# Altium schematic sheet io_connectors.SchDoc
size Tabloid; Organization: CMU Robotics Institute; Address1: Suite 780; Address2: 5001 Baum Blvd; Address3: Pittsburgh, PA 15213; Address4: USA
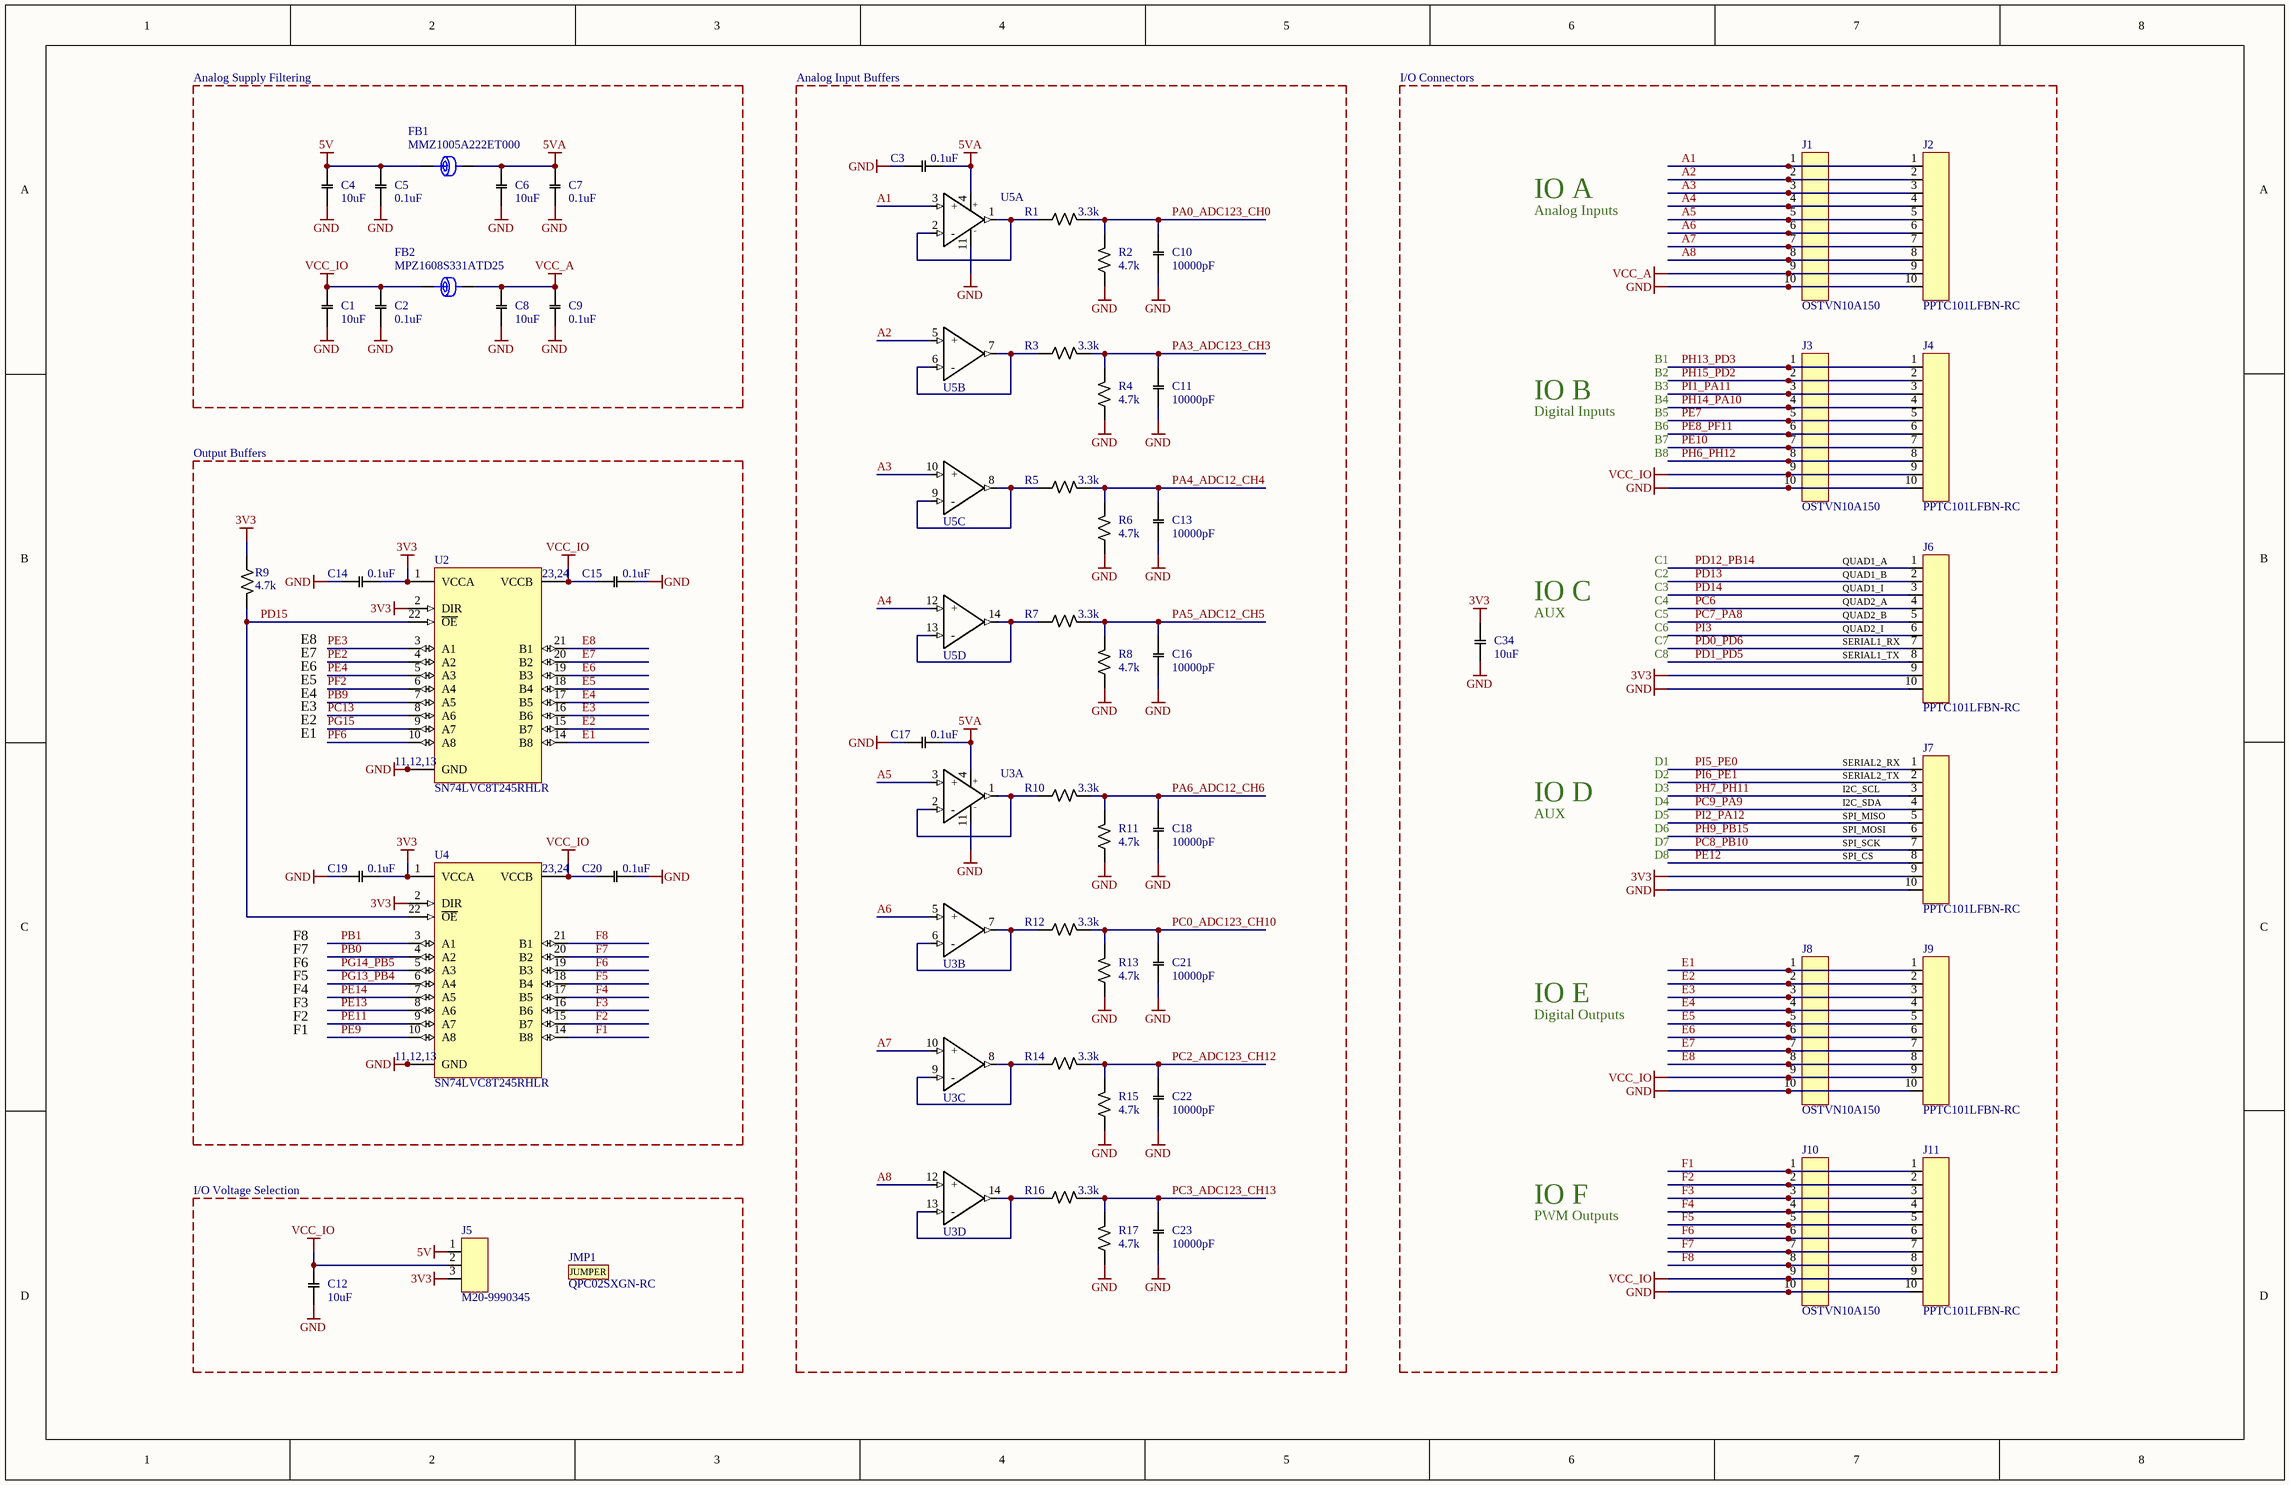
[diagram p0: io_connectors.SchDoc]

## Parts
C1  Capacitance: 10uF  [C0805]  (hidden comment: C-10uf-X5R-25V-10%-0805)
C2  Capacitance: 0.1uF  [C0402]  (hidden comment: C-0.1uf-X7R-25V-10%-0402)
C3  Capacitance: 0.1uF  [C0402]  (hidden comment: C-0.1uf-X7R-25V-10%-0402)
C4  Capacitance: 10uF  [C0805]  (hidden comment: C-10uf-X5R-25V-10%-0805)
C5  Capacitance: 0.1uF  [C0402]  (hidden comment: C-0.1uf-X7R-25V-10%-0402)
C6  Capacitance: 10uF  [C0805]  (hidden comment: C-10uf-X5R-25V-10%-0805)
C7  Capacitance: 0.1uF  [C0402]  (hidden comment: C-0.1uf-X7R-25V-10%-0402)
C8  Capacitance: 10uF  [C0805]  (hidden comment: C-10uf-X5R-25V-10%-0805)
C9  Capacitance: 0.1uF  [C0402]  (hidden comment: C-0.1uf-X7R-25V-10%-0402)
C10  Capacitance: 10000pF  [C0402]  (hidden comment: C-10000pf-X7R-50V-10%-0402)
C11  Capacitance: 10000pF  [C0402]  (hidden comment: C-10000pf-X7R-50V-10%-0402)
C12  Capacitance: 10uF  [C0805]  (hidden comment: C-10uf-X5R-25V-10%-0805)
C13  Capacitance: 10000pF  [C0402]  (hidden comment: C-10000pf-X7R-50V-10%-0402)
C14  Capacitance: 0.1uF  [C0402]  (hidden comment: C-0.1uf-X7R-25V-10%-0402)
C15  Capacitance: 0.1uF  [C0402]  (hidden comment: C-0.1uf-X7R-25V-10%-0402)
C16  Capacitance: 10000pF  [C0402]  (hidden comment: C-10000pf-X7R-50V-10%-0402)
C17  Capacitance: 0.1uF  [C0402]  (hidden comment: C-0.1uf-X7R-25V-10%-0402)
C18  Capacitance: 10000pF  [C0402]  (hidden comment: C-10000pf-X7R-50V-10%-0402)
C19  Capacitance: 0.1uF  [C0402]  (hidden comment: C-0.1uf-X7R-25V-10%-0402)
C20  Capacitance: 0.1uF  [C0402]  (hidden comment: C-0.1uf-X7R-25V-10%-0402)
C21  Capacitance: 10000pF  [C0402]  (hidden comment: C-10000pf-X7R-50V-10%-0402)
C22  Capacitance: 10000pF  [C0402]  (hidden comment: C-10000pf-X7R-50V-10%-0402)
C23  Capacitance: 10000pF  [C0402]  (hidden comment: C-10000pf-X7R-50V-10%-0402)
C34  Capacitance: 10uF  [C0805]  (hidden comment: C-10uf-X5R-25V-10%-0805)
FB1  MMZ1005A222ET000  [FB0402]
FB2  MPZ1608S331ATD25  [FB0603]
J1  OSTVN10A150  [OSTVN10A150]
J2  PPTC101LFBN-RC  [PPTC101LFBN-RC]
J3  OSTVN10A150  [OSTVN10A150]
J4  PPTC101LFBN-RC  [PPTC101LFBN-RC]
J5  M20-9990345  [M20-9990345]
J6  PPTC101LFBN-RC  [PPTC101LFBN-RC]
J7  PPTC101LFBN-RC  [PPTC101LFBN-RC]
J8  OSTVN10A150  [OSTVN10A150]
J9  PPTC101LFBN-RC  [PPTC101LFBN-RC]
J10  OSTVN10A150  [OSTVN10A150]
J11  PPTC101LFBN-RC  [PPTC101LFBN-RC]
JMP1  QPC02SXGN-RC  (mechanical)
R1  Resistance: 3.3k  [R0402]  (hidden comment: R-3.3k-0.1%-0.063w-0402)
R2  Resistance: 4.7k  [R0402]  (hidden comment: R-4.7k-0.1%-0.063w-0402)
R3  Resistance: 3.3k  [R0402]  (hidden comment: R-3.3k-0.1%-0.063w-0402)
R4  Resistance: 4.7k  [R0402]  (hidden comment: R-4.7k-0.1%-0.063w-0402)
R5  Resistance: 3.3k  [R0402]  (hidden comment: R-3.3k-0.1%-0.063w-0402)
R6  Resistance: 4.7k  [R0402]  (hidden comment: R-4.7k-0.1%-0.063w-0402)
R7  Resistance: 3.3k  [R0402]  (hidden comment: R-3.3k-0.1%-0.063w-0402)
R8  Resistance: 4.7k  [R0402]  (hidden comment: R-4.7k-0.1%-0.063w-0402)
R9  Resistance: 4.7k  [R0402]  (hidden comment: R-4.7k-1%-0.063w-0402)
R10  Resistance: 3.3k  [R0402]  (hidden comment: R-3.3k-0.1%-0.063w-0402)
R11  Resistance: 4.7k  [R0402]  (hidden comment: R-4.7k-0.1%-0.063w-0402)
R12  Resistance: 3.3k  [R0402]  (hidden comment: R-3.3k-0.1%-0.063w-0402)
R13  Resistance: 4.7k  [R0402]  (hidden comment: R-4.7k-0.1%-0.063w-0402)
R14  Resistance: 3.3k  [R0402]  (hidden comment: R-3.3k-0.1%-0.063w-0402)
R15  Resistance: 4.7k  [R0402]  (hidden comment: R-4.7k-0.1%-0.063w-0402)
R16  Resistance: 3.3k  [R0402]  (hidden comment: R-3.3k-0.1%-0.063w-0402)
R17  Resistance: 4.7k  [R0402]  (hidden comment: R-4.7k-0.1%-0.063w-0402)
U2  SN74LVC8T245RHLR  [R-PVQFN-N24_TI]
U3  TSV324IPT  [TSSOP14_ST]  (value not drawn)  (parts A,B,C,D of 4)
U4  SN74LVC8T245RHLR  [R-PVQFN-N24_TI]
U5  TSV324IPT  [TSSOP14_ST]  (value not drawn)  (parts A,B,C,D of 4)

## Blocks framed on the sheet
Analog Supply Filtering: C1 C2 C4-C9 FB1 FB2
Analog Input Buffers: C3 C10 C11 C13 C16-C18 C21-C23 R1-R8 R10-R17 U3 U5
I/O Voltage Selection: C12 J5 JMP1

## Nets
3V3: C14.2 C19.2 C34.2 J5.3 J6.9 J7.9 R9.1 U2.1(VCCA) U2.2(DIR) U4.1(VCCA) U4.2(DIR)
5V: C4.2 C5.1 FB1.1 J5.1
5VA: C3.1 C6.2 C7.1 C17.1 FB1.2 U3.4(V+) U5.4(V+)
GND: C1.1 C2.2 C3.2 C4.1 C5.2 C6.1 C7.2 C8.1 C9.1 C10.1 C11.1 C12.1 C13.1 C14.1 C15.1 C16.1 C17.2 C18.1 C19.1 C20.1 C21.1 C22.1 C23.1 C34.1 J1.10 J2.10 J3.10 J4.10 J6.10 J7.10 J8.10 J9.10 J10.10 J11.10 R2.1 R4.1 R6.1 R8.1 R11.1 R13.1 R15.1 R17.1 U2.11(GND) U2.12(GND) U2.13(GND) U3.11(V-) U4.11(GND) U4.12(GND) U4.13(GND) U5.11(V-)
VCC_A: C8.2 C9.2 FB2.2 J1.9 J2.9
VCC_IO: C1.2 C2.1 C12.2 C15.2 C20.2 FB2.1 J3.9 J4.9 J5.2 J8.9 J9.9 J10.9 J11.9 U2.23(VCCB) U2.24(VCCB) U4.23(VCCB) U4.24(VCCB)
A1: J1.1 J2.1 U5.3(+)
A2: J1.2 J2.2 U5.5(+)
A3: J1.3 J2.3 U5.10(+)
A4: J1.4 J2.4 U5.12(+)
A5: J1.5 J2.5 U3.3(+)
A6: J1.6 J2.6 U3.5(+)
A7: J1.7 J2.7 U3.10(+)
A8: J1.8 J2.8 U3.12(+)
E1: J8.1 J9.1 U2.14(B8)
E2: J8.2 J9.2 U2.15(B7)
E3: J8.3 J9.3 U2.16(B6)
E4: J8.4 J9.4 U2.17(B5)
E5: J8.5 J9.5 U2.18(B4)
E6: J8.6 J9.6 U2.19(B3)
E7: J8.7 J9.7 U2.20(B2)
E8: J8.8 J9.8 U2.21(B1)
F1: J10.1 J11.1 U4.14(B8)
F2: J10.2 J11.2 U4.15(B7)
F3: J10.3 J11.3 U4.16(B6)
F4: J10.4 J11.4 U4.17(B5)
F5: J10.5 J11.5 U4.18(B4)
F6: J10.6 J11.6 U4.19(B3)
F7: J10.7 J11.7 U4.20(B2)
F8: J10.8 J11.8 U4.21(B1)
PA0_ADC123_CH0: C10.2 R1.2 R2.2
PA3_ADC123_CH3: C11.2 R3.2 R4.2
PA4_ADC12_CH4: C13.2 R5.2 R6.2
PA5_ADC12_CH5: C16.2 R7.2 R8.2
PA6_ADC12_CH6: C18.2 R10.2 R11.2
PB0: U4.4(A2)
PB1: U4.3(A1)
PB9: U2.7(A5)
PC0_ADC123_CH10: C21.2 R12.2 R13.2
PC2_ADC123_CH12: C22.2 R14.2 R15.2
PC3_ADC123_CH13: C23.2 R16.2 R17.2
PC6: J6.4
PC7_PA8: J6.5
PC8_PB10: J7.7
PC9_PA9: J7.4
PC13: U2.8(A6)
PD0_PD6: J6.7
PD1_PD5: J6.8
PD12_PB14: J6.1
PD13: J6.2
PD14: J6.3
PD15: R9.2 U2.22(~{OE}) U4.22(~{OE})
PE2: U2.4(A2)
PE3: U2.3(A1)
PE4: U2.5(A3)
PE7: J3.5 J4.5
PE8_PF11: J3.6 J4.6
PE9: U4.10(A8)
PE10: J3.7 J4.7
PE11: U4.9(A7)
PE12: J7.8
PE13: U4.8(A6)
PE14: U4.7(A5)
PF2: U2.6(A4)
PF6: U2.10(A8)
PG13_PB4: U4.6(A4)
PG14_PB5: U4.5(A3)
PG15: U2.9(A7)
PH6_PH12: J3.8 J4.8
PH7_PH11: J7.3
PH9_PB15: J7.6
PH13_PD3: J3.1 J4.1
PH14_PA10: J3.4 J4.4
PH15_PD2: J3.2 J4.2
PI1_PA11: J3.3 J4.3
PI2_PA12: J7.5
PI3: J6.6
PI5_PE0: J7.1
PI6_PE1: J7.2
NetR1_1: R1.1 U5.1(OUT) U5.2(-)
NetR3_1: R3.1 U5.6(-) U5.7(OUT)
NetR5_1: R5.1 U5.8(OUT) U5.9(-)
NetR7_1: R7.1 U5.13(-) U5.14(OUT)
NetR10_1: R10.1 U3.1(OUT) U3.2(-)
NetR12_1: R12.1 U3.6(-) U3.7(OUT)
NetR14_1: R14.1 U3.8(OUT) U3.9(-)
NetR16_1: R16.1 U3.13(-) U3.14(OUT)

## Notes on the sheet
- I/O Connectors
- IO A
- Analog Inputs
- B1
- IO B
- Digital Inputs
- B2
- B3
- B4
- B5
- B6
- Output Buffers
- B7
- B8
- C1
- (near J6) QUAD1_A
- IO C
- AUX
- C2
- C3
- C4
- C5
- C6
- (near J6) QUAD1_B
- (near J6) QUAD1_I
- (near J6) QUAD2_A
- (near J6) QUAD2_B
- (near J6) QUAD2_I
- E4
- E5
- E6
- E7
- E8
- C7
- C8
- (near J6) SERIAL1_RX
- (near J6) SERIAL1_TX
- E1
- E2
- E3
- D1
- (near J7) SERIAL2_RX
- IO D
- D2
- D3
- D4
- D5
- D6
- (near J7) SPI_MISO
- (near J7) I2C_SCL
- (near J7) I2C_SDA
- (near J7) SERIAL2_TX
- (near J7) SPI_MOSI
- D7
- D8
- (near J7) SPI_SCK
- (near J7) SPI_CS
- F8
- F7
- F6
- F5
- F4
- F3
- F2
- F1
- IO E
- Digital Outputs
- IO F
- PWM Outputs
- Title
- Size:
- Date:
- Tabloid
- Number:
- Time:
- Revision:
- Sheet
- of
- File:
- (in symbol CMP-500-0004-4) 23,24; 11,12,13
- (in symbol CMP-1305-000000-1) JUMPER

## Library data of the parts
C1 C4 C6 C8 C12 C34 = CMP-00042-6: Capacitor Ceramic 10uF 25V X5R 10% SMD 0805; Tolerance: 10%; Voltage - Rated: 25V; Temperature Coefficient: X5R; Operating Temperature: -55°C ~ 85°C; Package / Case: 0805
C2 C3 C5 C7 C9 C14 C15 C17 C19 C20 = CMP-00040-11: Capacitor Ceramic 0.1uF 25V X7R 10% SMD 0402; Tolerance: 10%; Voltage - Rated: 25V; Temperature Coefficient: X7R; Operating Temperature: -55°C ~ 125°C; Package / Case: 0402
C10 C11 C13 C16 C18 C21-C23 = CMP-00041-8: Capacitor Ceramic 10000pF 50V X7R 10% SMD 0402; Tolerance: 10%; Voltage - Rated: 50V; Temperature Coefficient: X7R; Operating Temperature: -55°C ~ 125°C; Package / Case: 0402
FB1 = CMP-00233-4: FERRITE BEAD 2.2 KOHM 0402 1LN; Filter Type: Signal Line; Number of Lines: 1; Current Rating (Max): 150mA; DC Resistance (DCR) (Max): 2.2 Ohm; ComponentLink1URL: https://product.tdk.com/info/en/catalog/datasheets/beads_commercial_signal_mmz1005-e_en.pdf; ComponentLink1Description: Datasheet; Lead Free Status / RoHS Status: RoHS Compliant; Category: Filters; Package / Case: 0402 (1005 Metric); Mounting Type: Surface Mount; Height (Max): 0.022" (0.55mm); Size / Dimension: 0.039" L x 0.020" W (1.00mm x 0.50mm); Ratings: -; Operating Temperature: -55°C ~ 125°C
FB2 = CMP-00231-5: FERRITE CHIP 330 OHM 1.7A 0603; DC Resistance (DCR): 80 mOhm Max; ComponentLink1URL: http://product.tdk.com/en/catalog/datasheets/beads_automotive_power_mpz_en.pdf; ComponentLink1Description: Datasheet; Lead Free Status / RoHS Status: RoHS Compliant; Category: Filters; Filter Type: -; Package / Case: 0603 (1608 Metric); Mounting Type: Surface Mount; Height (Max): 0.037" (0.95mm); Size / Dimension: 0.063" L x 0.031" W (1.60mm x 0.80mm); Current Rating: 1.7A
J1 J3 J8 J10 = CMP-00332-3: CONN TERM BLOCK 2.54MM 10POS PCB; Manufacturer: On Shore Technology Inc.; Pitch: 0.100" (2.54mm); Number of Levels: 1; Positions Per Level: 10; Mating Orientation: Horizontal with Board; Current: 6A; Voltage: 125V; Wire Gauge: 20-30 AWG; Wire Termination: Screw - Rising Cage Clamp; Clamp Material - Plating: Brass; Screw Material - Plating: Steel - Zinc Plated; Torque - Screw: 0.15 Nm (1.3 Lb-In); Screw Thread: M1.6; Manufacturer Part Number: OSTVN10A150; Lead Free Status / RoHS Status: RoHS Compliant; Category: Connectors, Interconnects; Mounting Type: Through Hole; Features: -; Color: Green; ComponentLink1URL: http://www.on-shore.com/sites/default/files/manuals/ostvnxxa150.pdf; ComponentLink1Description: Datasheet; Operating Temperature: -30°C ~ 105°C; Housing Material: Thermoplastic; Contact Material - Plating: Brass
J2 J4 J6 J7 J9 J11 = CMP-391-0001-1: CONN HEADER FEMALE 10POS.1" TIN; Manufacturer: Sullins Connector Solutions; Pitch: 0.100" (2.54mm); Number of Positions: 10; Number of Positions Loaded: All; Manufacturer Part Number: PPTC101LFBN-RC; Lead Free Status / RoHS Status: RoHS Compliant; Category: Connectors, Interconnects; Mounting Type: Through Hole; Features: -; Color: Black; ComponentLink1URL: Datasheet; ComponentLink1Description: http://www.sullinscorp.com/drawings/78_P(N)PxCxxxLFBN-RC,_10492-H.pdf; Connector Type: Header; Contact Type: Female Socket; Number of Rows: 1; Row Spacing: -; Termination: Solder; Fastening Type: -; Contact Finish: Tin; Contact Finish Thickness: -
J5 = CMP-00314-2: CONN HEADER VERT 3POS 2.54MM; Manufacturer: Harwin Inc.; Connector Type: Header, Unshrouded, Breakaway; Number of Positions: 3; Number of Positions Loaded: All; Pitch: 0.100" (2.54mm); Manufacturer Part Number: M20-9990345; Lead Free Status / RoHS Status: RoHS Compliant; ComponentLink1Description: Datasheet; ComponentLink1URL: http://cdn.harwin.com/pdfs/M20-999.pdf; Category: Connectors, Interconnects; Contact Type: Male Pin; Number of Rows: 1; Row Spacing: -; Contact Mating Length: 0.240" (6.10mm); Mounting Type: Through Hole; Termination: Solder; Fastening Type: -; Features: -; Contact Finish: Gold; Contact Finish Thickness: -; Color: Black
JMP1 = CMP-1305-000000-1: CONN JUMPER SHORTING .100" GOLD; Manufacturer: Sullins; Pitch: 0.1inch; Number of Positions: 2; Manufacturer Part Number: QPC02SXGN-RC; Lead Free Status / RoHS Status: RoHS Compliant; Height: 0.235inch; ComponentLink1URL: https://s3.amazonaws.com/catalogspreads-pdf/PAGE128-129%20.100%20JUMPER.pdf; ComponentLink1Description: https://s3.amazonaws.com/catalogspreads-pdf/PAGE128-129%20.100%20JUMPER.pdf; Case/Package: 100; Contact Plating: Gold; Package Quantity: 2000; Lead Free: Lead Free
R1 R3 R5 R7 R10 R12 R14 R16 = CMP-00138-3: Resistor 0402 3.3k Ohm 0.1% 1-16 Watt; Power: 0.063W, 1/16W; Package / Case: 0402; Part Name: R-3.3k-0.1%-0.063w-0402; Tolerance (%): ±0.1%
R2 R4 R6 R8 R11 R13 R15 R17 = CMP-00137-3: Resistor 0402 4.7k Ohm 0.1% 1-16 Watt; Power: 0.063W, 1/16W; Package / Case: 0402; Part Name: R-4.7k-0.1%-0.063w-0402; Tolerance (%): ±0.1%
R9 = CMP-00107-4: Resistor 0402 4.7k Ohm 1% 1-16 Watt; Power: 0.063W, 1/16W; Package / Case: 0402; Part Name: R-4.7k-1%-0.063w-0402; Tolerance (%): ±1%
U2 U4 = CMP-500-0004-4: IC BUS TRANSCVR 8BIT 24QFN; Data Rate: 500Mbps; Logic Function: Translator,Transceiver; Number of Bits: 8; Quiescent Current: 15uA; Min Supply Voltage: 1.65V; Max Supply Voltage: 5.5V; Propagation Delay: 4.3ns; Polarity: Non-Inverting; Direction: Bidirectional; Number of Elements: 1; Turn-On Delay Time: 4.2ns; Low Level Output Current: 32mA; High Level Output Current: -32mA; ComponentLink1Description: Datasheet; ComponentLink1URL: https://www.ti.com/lit/ds/symlink/sn74lvc8t245.pdf?HQS=dis-dk-null-digikeymode-dsf-pf-null-wwe&ts=1610745639078; Number of Channels: 8; REACH SVHC: No SVHC; Contact Plating: Gold; Max Operating Temperature: 85°C; Radiation Hardening: No; Height: 0.95mm; Packaging: Tape and Reel; Nominal Supply Current: 15uA; Number of Pins: 24; Package Quantity: 1; Lead Free: Lead Free; Weight: 0.001767oz; Min Operating Temperature: -40°C; Number of Outputs: 8; Width: 3.65mm; Number of Inputs: 8; Case/Package: VQFN; Mount: Surface Mount; Length: 5.65mm; Output Current: 32mA
U3 U5 = CMP-736-0002-1: IC OPAMP GP 1.4MHZ RRO 14TSSOP; Manufacturer: STMicroelectronics; Amplifier Type: General Purpose; Current - Input Bias: 70nA; Current - Output / Channel: 80mA; Current - Supply: 500µA; Number of Circuits: 4; Output Type: Rail-to-Rail; Slew Rate: 0.6 V/µs; Voltage - Input Offset: 200µV; Voltage - Supply, Single/Dual (±): 2.5 V ~ 6 V; Manufacturer Part Number: TSV324IPT; ComponentLink1Description: Datasheet; ComponentLink1URL: http://www.st.com/web/en/resource/technical/document/datasheet/CD00063292.pdf; -3db Bandwidth: -; Category: Integrated Circuits (ICs); Gain Bandwidth Product: 1.4MHz; Lead Free Status / RoHS Status: RoHS Compliant; Mounting Type: Surface Mount; Operating Temperature: -40°C ~ 125°C; Package / Case: 14-TSSOP (0.173", 4.40mm Width); Supplier Device Package: 14-TSSOP